# EAGLE design volume_board_v3 (EAGLE 8.4.3)
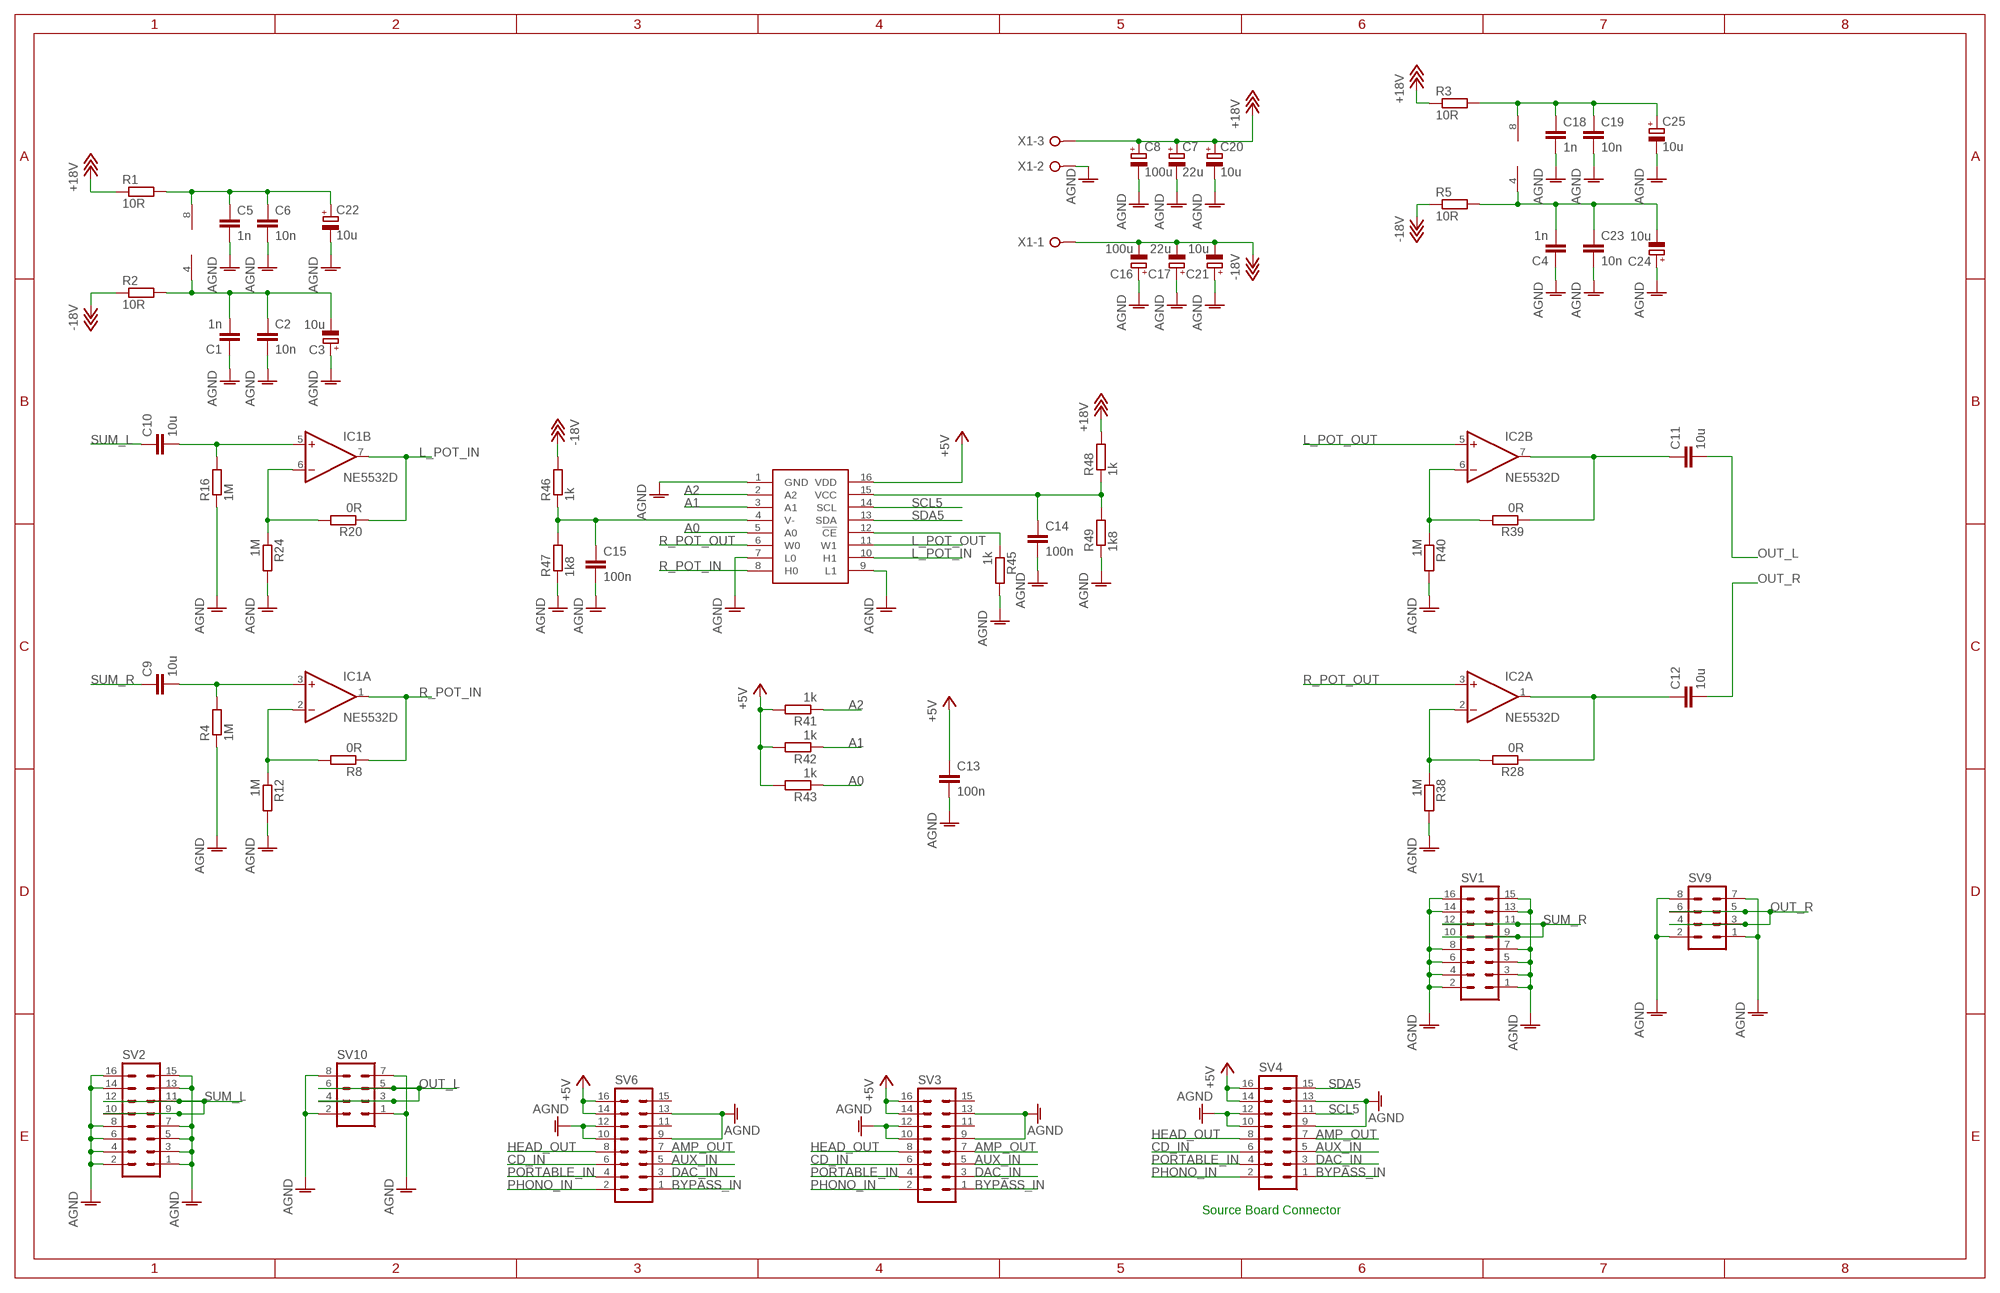
[diagram p0: schematic, sheet 1]

## Parts
C1  1n  C-EUC0603  [C0603]
C2  10n  C-EUC0603  [C0603]
C3  10u  CPOL-EU153CLV-0405  [153CLV-0405]
C4  1n  C-EUC0603  [C0603]
C5  1n  C-EUC0603  [C0603]
C6  10n  C-EUC0603  [C0603]
C7  22u  CPOL-EU153CLV-0405  [153CLV-0405]
C8  100u  CPOL-EU153CLV-0605  [153CLV-0605]
C9  10u  C5/7.2/11  [C5B7.2_11]
C10  10u  C5/7.2/11  [C5B7.2_11]
C11  10u  C5/7.2/11  [C5B7.2_11]
C12  10u  C5/7.2/11  [C5B7.2_11]
C13  100n  C-EUC0603  [C0603]
C14  100n  C-EUC0603  [C0603]
C15  100n  C-EUC0603  [C0603]
C16  100u  CPOL-EU153CLV-0605  [153CLV-0605]
C17  22u  CPOL-EU153CLV-0405  [153CLV-0405]
C18  1n  C-EUC0603  [C0603]
C19  10n  C-EUC0603  [C0603]
C20  10u  CPOL-EU153CLV-0405  [153CLV-0405]
C21  10u  CPOL-EU153CLV-0405  [153CLV-0405]
C22  10u  CPOL-EU153CLV-0405  [153CLV-0405]
C23  10n  C-EUC0603  [C0603]
C24  10u  CPOL-EU153CLV-0405  [153CLV-0405]
C25  10u  CPOL-EU153CLV-0405  [153CLV-0405]
IC1  NE5532D  [SO08]
IC2  NE5532D  [SO08]
IC4  DS1882  [SO16]
R1  10R  R-EU_R0603  [R0603]
R2  10R  R-EU_R0603  [R0603]
R3  10R  R-EU_R0603  [R0603]
R4  1M  R-EU_R0603  [R0603]
R5  10R  R-EU_R0603  [R0603]
R8  0R  R-EU_R0603  [R0603]
R12  1M  R-EU_R0603  [R0603]
R16  1M  R-EU_R0603  [R0603]
R20  0R  R-EU_R0603  [R0603]
R24  1M  R-EU_R0603  [R0603]
R28  0R  R-EU_R0603  [R0603]
R38  1M  R-EU_R0603  [R0603]
R39  0R  R-EU_R0603  [R0603]
R40  1M  R-EU_R0603  [R0603]
R41  1k  R-EU_R0603  [R0603]
R42  1k  R-EU_R0603  [R0603]
R43  1k  R-EU_R0603  [R0603]
R45  1k  R-EU_R0603  [R0603]
R46  1k  R-EU_R0603  [R0603]
R47  1k8  R-EU_R0603  [R0603]
R48  1k  R-EU_R0603  [R0603]
R49  1k8  R-EU_R0603  [R0603]
SV1  MA08-2  [MA08-2]
SV2  MA08-2  [MA08-2]
SV3  MA08-2  [MA08-2]
SV4  MA08-2B  [MA08-2_BORDER]
SV6  MA08-2  [MA08-2]
SV9  MA04-2  [MA04-2]
SV10  MA04-2  [MA04-2]
X1  W237-3E  [W237-3E]

## Nets
+5V: C13.1 IC4.16(VDD) R41.2 R42.2 R43.2 SV3.14 SV3.16 SV4.14 SV4.16 SV6.14 SV6.16
+18V: C7.+ C8.+ C20.+ R1.1 R3.1 R48.2 X1.3
-18V: C16.- C17.- C21.- R2.1 R5.1 R46.2 X1.1
A0: IC4.5(A0) R43.1
A1: IC4.3(A1) R42.1
A2: IC4.2(A2) R41.1
AMP_OUT: SV3.7 SV4.7 SV6.7
AUX_IN: SV3.5 SV4.5 SV6.5
BYPASS_IN: SV3.1 SV4.1 SV6.1
CD_IN: SV3.6 SV4.6 SV6.6
DAC_IN: SV3.3 SV4.3 SV6.3
GND: C1.1 C2.2 C3.+ C4.1 C5.2 C6.2 C7.- C8.- C13.2 C14.2 C15.2 C16.+ C17.+ C18.2 C19.2 C20.- C21.+ C22.- C23.2 C24.+ C25.- IC4.1(GND) IC4.7(L0) IC4.9(L1) R4.1 R12.2 R16.1 R24.2 R38.2 R40.2 R45.2 R47.1 R49.1 SV1.1 SV1.2 SV1.3 SV1.4 SV1.5 SV1.6 SV1.7 SV1.8 SV1.13 SV1.14 SV1.15 SV1.16 SV2.1 SV2.2 SV2.3 SV2.4 SV2.5 SV2.6 SV2.7 SV2.8 SV2.13 SV2.14 SV2.15 SV2.16 SV3.9 SV3.10 SV3.12 SV3.13 SV4.9 SV4.10 SV4.12 SV4.13 SV6.9 SV6.10 SV6.12 SV6.13 SV9.1 SV9.2 SV9.7 SV9.8 SV10.1 SV10.2 SV10.7 SV10.8 X1.2 ; supply symbol labelled AGND
HEAD_OUT: SV3.8 SV4.8 SV6.8
L_POT_IN: IC1.7(B:OUT) IC4.10(H1) R20.1
L_POT_OUT: IC2.5(B:+IN) IC4.11(W1)
N$1: C1.2 C2.1 C3.- IC1.4(P:V-) R2.2
N$2: C5.1 C6.1 C22.+ IC1.8(P:V+) R1.2
N$3: C18.1 C19.1 C25.+ IC2.8(P:V+) R3.2
N$4: C4.2 C23.1 C24.- IC2.4(P:V-) R5.2
N$28: IC1.2(A:-IN) R8.2 R12.1
N$30: C9.2 IC1.3(A:+IN) R4.2
N$31: IC1.6(B:-IN) R20.2 R24.1
N$32: C10.2 IC1.5(B:+IN) R16.2
N$35: IC2.2(A:-IN) R28.2 R38.1
N$36: IC2.6(B:-IN) R39.2 R40.1
N$37: C11.1 IC2.7(B:OUT) R39.1
N$38: C12.1 IC2.1(A:OUT) R28.1
N$41: IC4.12(!CE) R45.1
N$42: C15.1 IC4.4(V-) R46.1 R47.2
N$43: C14.1 IC4.15(VCC) R48.1 R49.2
OUT_L: C11.2 SV10.3 SV10.4 SV10.5 SV10.6
OUT_R: C12.2 SV9.3 SV9.4 SV9.5 SV9.6
PHONO_IN: SV3.2 SV4.2 SV6.2
PORTABLE_IN: SV3.4 SV4.4 SV6.4
R_POT_IN: IC1.1(A:OUT) IC4.8(H0) R8.1
R_POT_OUT: IC2.3(A:+IN) IC4.6(W0)
SCL5: IC4.14(SCL) SV4.11
SDA5: IC4.13(SDA) SV4.15
SUM_L: C10.1 SV2.9 SV2.10 SV2.11 SV2.12
SUM_R: C9.1 SV1.9 SV1.10 SV1.11 SV1.12
Unconnected: SV3.11 SV3.15 SV6.11 SV6.15

## Notes on the sheet
- Source Board Connector

## Library data of the parts
C1 C2 C4-C6 C13-C15 C18 C19 C23 = rcl:C-EU: CAPACITOR, European symbol
C3 C7 C8 C16 C17 C20-C22 C24 C25 = rcl:CPOL-EU: POLARIZED CAPACITOR, European symbol
C9-C12 = capacitor-wima:C: CAPACITOR naming: grid - package width
IC1 IC2 = linear:NE5532: AUDIO AMPLIFIER
IC4 = ds1882:DS1882
R1-R3 R5 = rcl:R-EU_: RESISTOR, European symbol
R4 R8 R12 R16 R20 R24 R28 R38-R43 R45-R49 = resistor:R-EU_: RESISTOR, European symbol
SV1-SV3 SV6 = con-lstb:MA08-2: PIN HEADER; OC_FARNELL: unknown; OC_NEWARK: unknown
SV4 = con-lstb:MA08-2: PIN HEADER
SV9 SV10 = con-lstb:MA04-2: PIN HEADER; OC_FARNELL: unknown; OC_NEWARK: unknown
X1 = con-wago-508:W237-3E: WAGO SREW CLAMP; OC_FARNELL: unknown; OC_NEWARK: unknown

## Board
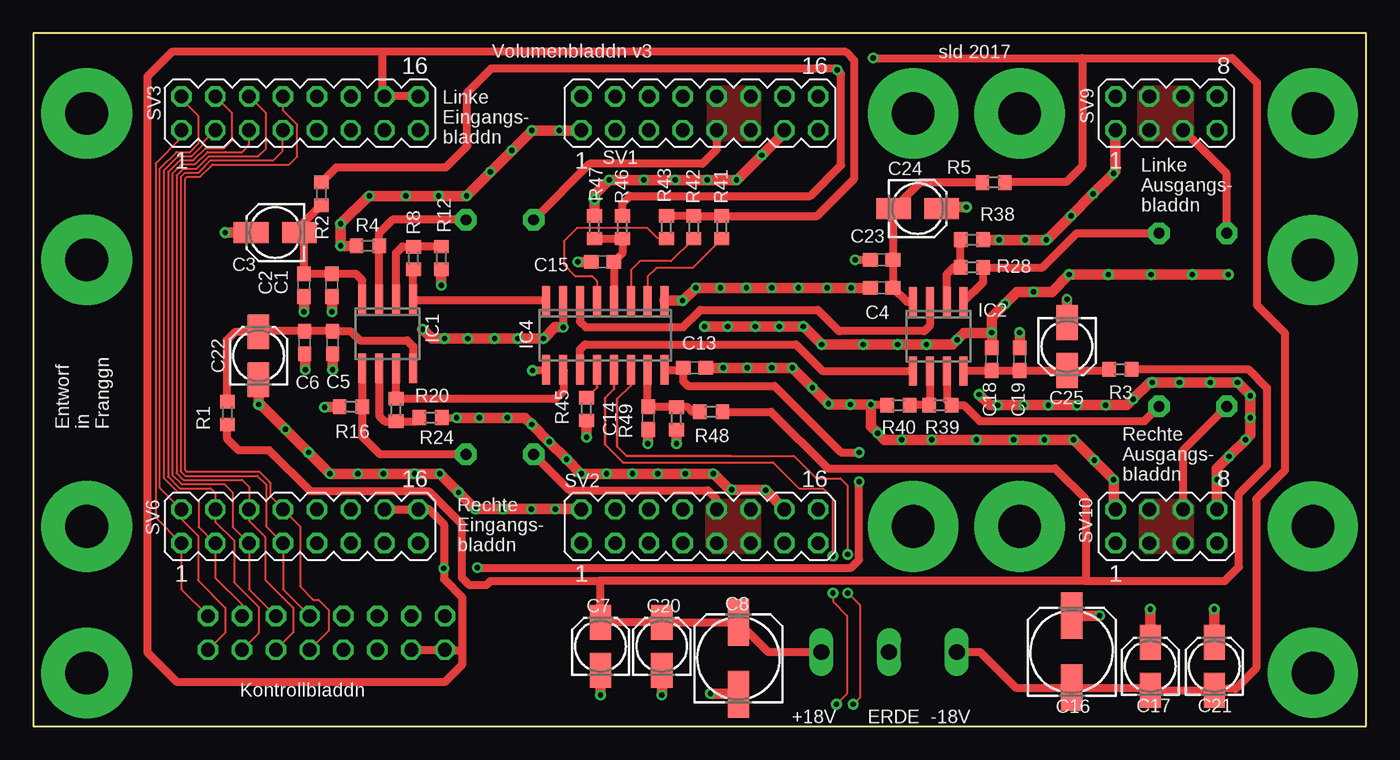
[diagram p1: board, top side]
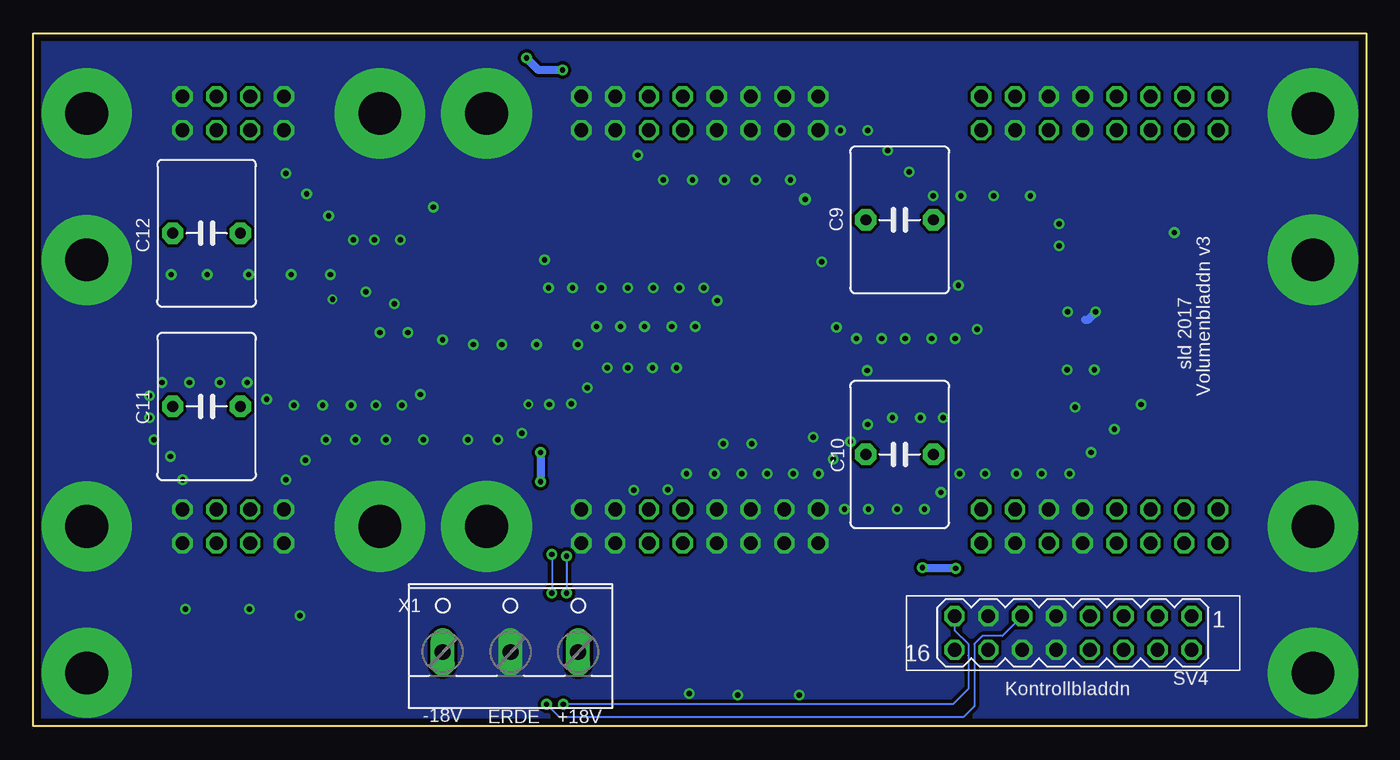
[diagram p2: board, bottom side, seen from below]

Size 100 x 52 mm. Coordinates in mm from the lower left corner, seen from the top.
Outline: 0,0 100,0 100,52 0,52 0,0
Copper layers (1*16): Top 0.035mm / dielectric 1.6mm / Bottom 0.035mm
Design rules "Elecrow_2-layer_PCB_eagle_rule": minimum track width 6mil, minimum drill 12mil, track to track 6mil, track to pad 8mil, pad to pad 12mil, via to via 12mil, smd to smd 0mil, copper to edge 20mil, drill to drill 10mil, minimum pad ring 6mil, minimum via ring 6mil, stop-mask expansion 0mil, vias tented up to drill 100mil, thermal gap 10mil

### Footprints (pad centres in the part's own frame; a part is rotated, then mirrored left to right if it is on the bottom)
C0603 = smd 1.1 x 1: 1 -0.85,0; 2 0.85,0
153CLV-0405 = smd 2.6 x 1.6: + 1.8,0; - -1.8,0
153CLV-0605 = smd 3.5 x 1.6: + 2.7,0; - -2.7,0
C5B7.2_11 = drill 0.813 pad 1.6 octagon: 1 -2.54,0; 2 2.54,0
SO08 = smd 0.6 x 2.2: 1 -1.905,-2.6; 2 -0.635,-2.6; 3 0.635,-2.6; 4 1.905,-2.6; 5 1.905,2.6; 6 0.635,2.6; 7 -0.635,2.6; 8 -1.905,2.6
SO16 = smd 0.6 x 2.2: 1 -4.445,-2.6; 2 -3.175,-2.6; 3 -1.905,-2.6; 4 -0.635,-2.6; 5 0.635,-2.6; 6 1.905,-2.6; 7 3.175,-2.6; 8 4.445,-2.6; 9 4.445,2.6; 10 3.175,2.6; 11 1.905,2.6; 12 0.635,2.6; 13 -0.635,2.6; 14 -1.905,2.6; 15 -3.175,2.6; 16 -4.445,2.6
R0603 = smd 1 x 1.1: 1 -0.85,0; 2 0.85,0
MA08-2 = drill 1.016 octagon: 1 -8.89,-1.27; 2 -8.89,1.27; 3 -6.35,-1.27; 4 -6.35,1.27; 5 -3.81,-1.27; 6 -3.81,1.27; 7 -1.27,-1.27; 8 -1.27,1.27; 9 1.27,-1.27; 10 1.27,1.27; 11 3.81,-1.27; 12 3.81,1.27; 13 6.35,-1.27; 14 6.35,1.27; 15 8.89,-1.27; 16 8.89,1.27
MA08-2_BORDER = drill 1.016 octagon: 1 -8.89,-1.27; 2 -8.89,1.27; 3 -6.35,-1.27; 4 -6.35,1.27; 5 -3.81,-1.27; 6 -3.81,1.27; 7 -1.27,-1.27; 8 -1.27,1.27; 9 1.27,-1.27; 10 1.27,1.27; 11 3.81,-1.27; 12 3.81,1.27; 13 6.35,-1.27; 14 6.35,1.27; 15 8.89,-1.27; 16 8.89,1.27
MA04-2 = drill 1.016 octagon: 1 -3.81,-1.27; 2 -3.81,1.27; 3 -1.27,-1.27; 4 -1.27,1.27; 5 1.27,-1.27; 6 1.27,1.27; 7 3.81,-1.27; 8 3.81,1.27
W237-3E = drill 1.194 long: 1 -5.08,-0.635; 2 0,-0.635; 3 5.08,-0.635

### Placement (x,y rotation side)
C1  22.4,33.1 90 top
C2  20.3,33.1 270 top
C3  18.15,37.05 180 top
C4  63.65,32.9 0 top
C5  22.45,28.8 270 top
C6  20.35,28.8 270 top
C7  42.55,6 90 top
C8  52.9,5.1 90 top
C9  35,38 0 bottom
C10  35,20.4 0 bottom
C11  87,24 180 bottom
C12  87,37 180 bottom
C13  49.6,26.9 0 top
C14  46.13,23.12 270 top
C15  42.7,34.85 180 top
C16  77.9,5.6 90 top
C17  83.8,4.5 90 top
C18  71.9,27.55 90 top
C19  74,27.55 90 top
C20  47.15,6 90 top
C21  88.6,4.5 90 top
C22  16.9,27.8 90 top
C23  63.65,35 180 top
C24  66.35,38.85 0 top
C25  77.55,28.5 270 top
IC1  26.58,29.46 180 top
IC2  67.89,29.26 180 top
IC4  42.92,29.34 180 top
R1  14.55,23.5 90 top
R2  21.6,39.95 270 top
R3  81.55,26.8 180 top
R4  25.1,36.05 0 top
R5  72.05,40.8 180 top
R8  28.53,35.13 90 top
R12  30.6,35.15 270 top
R16  23.83,23.97 0 top
R20  27.22,23.73 270 top
R24  29.8,23.17 0 top
R28  70.42,34.43 180 top
R38  70.42,36.52 0 top
R39  68.05,24.1 180 top
R40  64.9,24.1 180 top
R41  51.65,37.45 90 top
R42  49.55,37.45 90 top
R43  47.5,37.45 90 top
R45  41.5,23.8 270 top
R46  44.2,37.45 90 top
R47  42.1,37.45 270 top
R48  50.85,23.6 0 top
R49  48.25,23.1 90 top
SV1  50,46 0 top
SV2  50,15 0 top
SV3  20,46 0 top
SV4  22,7 180 bottom
SV6  20,15 0 top
SV9  85,46 0 top
SV10  85,15 0 top
X1  64.2,6.2 0 bottom

### Tracks (layer width: path | path; a pad name or v marks a point on that pad's centre or on a via)
+5V  (via drill 0.4 pad 0.8)
  Top 0.4: SV3.16
  Top 0.6: SV6.14 SV6.16 29.68,16.27 30.8,15.15 v30.8,11.85 30.8,11.05 32.2,9.65 32.2,5.7 | SV3.16 SV3.14 26.2,47.42 26.2,50.6 | SV4.14 SV4.16 30.92,5.7 32.2,5.7 | R43.2 R42.2 R41.2 58.8,38.3 61.6,41.1 61.6,49.95 60.95,50.6 26.2,50.6 | 47.37,26.08 IC4.16 48.59,26.74 C13.1 48.75,25.9 49.1,25.55 55.6,25.55 60.6,20.55 v61.95,20.55 | 26.2,50.6 10.4,50.6 8.55,48.75 8.55,5.55 10.75,3.35 30.9,3.35 32.2,4.65 32.2,5.7 | v33.3,11.9 61.35,11.9 61.95,12.5 v61.95,18.35
  Bottom 0.6: v33.3,11.9 30.85,11.9 v30.8,11.85 | v61.95,20.55 v61.95,18.35
+18V
  Top 0.6: R3.1 91.15,26.8 92.55,25.4 92.55,19.55 90.45,17.45 90.45,11.95 89.4,10.9 78.95,10.9 | R48.2 55.35,23.6 59.6,19.35 76.65,19.35 78.95,17.05 78.95,10.9 | R1.1 14.55,21.55 15.4,20.7 17.7,20.7 20.75,17.65 29.65,17.65 32.15,15.15 32.15,11.15 32.7,10.6 34,10.6 34.3,10.9 42.4,10.9 | X1.3 55.13,5.57 C8.+ C20.+ C7.+ 42.55,10.75 42.4,10.9 | 78.95,10.9 42.4,10.9
-18V  (via drill 0.4 pad 0.8)
  Top 0.6: X1.1 71.03,5.57 73.7,2.9 C16.- 83.6,2.9 C17.- C21.- 88.7,2.8 90.2,2.8 91.75,4.35 91.75,17.05 93.9,19.2 93.9,29.5 91.8,31.6 91.8,48.3 89.95,50.15 78.7,50.15 | R2.1 22.75,41.95 30.95,41.95 32.55,43.55 32.55,47.55 34.35,49.35 60.2,49.35 v60.3,49.25 60.6,48.95 60.6,42.1 58.3,39.8 44.75,39.8 44.2,39.25 R46.2 | R5.1 73.05,40.85 77.5,40.85 78.7,42.05 78.7,50.15 | v63,50.15 78.7,50.15
  Bottom 0.6: v60.3,49.25 62.1,49.25 v63,50.15
A0
  Top 0.16: R43.1 46.85,36.6 46.07,37.38 40.78,37.38 39.8,36.4 39.8,34.65 40.65,33.8 41.9,33.8 42.3,33.4 42.29,33.39 IC4.5
A1
  Top 0.16: R42.1 47.85,34.9 45.5,34.9 44.83,34.23 IC4.3
A2
  Top 0.16: R41.1 49.45,34.4 46.75,34.4 46.1,33.75 IC4.2
AMP_OUT
  Top 0.16: SV3.7 18.7,44.7 18.7,43.15 18.01,42.46 13.32,42.46 12.4,41.54 11.4,41.54 11.05,41.2 11.05,19.12 11.38,18.8 16.8,18.8 17.45,18.15 17.45,15.01 SV6.7 18.73,10.27 SV4.7
AUX_IN
  Top 0.16: SV3.5 16.19,43.64 15.65,43.1 14.44,43.1 14.43,43.09 13.06,43.09 12.14,42.16 11.14,42.16 10.43,41.45 10.43,18.86 11.12,18.18 14.32,18.18 14.95,17.55 14.95,14.97 SV6.5 16.19,10.27 SV4.5
BYPASS_IN
  Top 0.16: SV3.1 11.11,44.16 9.18,42.23 9.18,15.66 SV6.1 11.11,10.27 SV4.1
CD_IN
  Top 0.16: SV3.6 17.45,46.01 17.45,43.35 16.88,42.77 13.19,42.77 12.27,41.85 11.27,41.85 10.74,41.33 10.74,18.99 11.25,18.49 15.66,18.49 16.2,17.95 SV6.6 16.19,15.41 17.4,14.2 17.4,11 19.5,8.9 19.5,7.04 SV4.6
DAC_IN
  Top 0.16: 13.65,13.7 12.4,14.95 12.4,16.9 11.75,17.55 10.86,17.55 9.8,18.6 9.8,41.71 10.88,42.79 11.88,42.79 12.71,43.62 12.71,43.79 SV3.3 | SV6.3 13.65,11.15 15.65,9.15 SV4.3
  Top 0.2: 13.65,13.7 SV6.3
GND  (via drill 0.4, 0.4 pad 0.8, 0.4 pad 0.9, 3.2 pad 6.75, 3.2 pad 6.8)
  Top 0.6: 21.87,23.97 v21.85,23.95 | R24.2 v31.75,23.15 | C6.2 20.4,27.9 | IC4.7 v39.75,29.95 | IC4.9 38.43,26.7 v37.45,26.7 | C23.2 v61.65,35 | C24.+ 68.25,38.95 | R38.2 71.28,36.5 | R40.2 62.9,24.1 v62.85,24.15 | 71.9,29.5 v71.9,29.55 | 46.13,21.23 v46.1,21.2 | C8.- 52.85,2.45
  Top 0.8: 56.4,16.25 v54.95,17.7 54.9,17.75 v52.4,17.75 52.25,17.75 51.05,18.95 v51,18.95 v48.9,18.95 v46.85,18.95 v44.95,18.95 v43,18.95 v41.1,18.95 v40,20.05 v38.7,21.35 v37.4,22.65 36.9,23.15 v35.55,23.15 v33.45,23.15 v31.75,23.15 | R47.1 v42.1,39.55 42.1,39.9 v43.2,41 v45.8,41 v48.15,41 v50.55,41 v52.75,41 52.8,41 v54.65,42.85 56.4,44.6 | C16.+ v80,8.3 | C17.+ v83.8,8.8 | C21.+ v88.6,8.8 | R45.2 v41.5,21.7 | R4.1 v23.05,36.05 v23.05,37.7 25.15,39.8 v25.2,39.8 v27.95,39.8 v30.4,39.8 v32.5,39.8 v34.3,41.6 v35.9,43.2 v37.4,44.7 v39.45,44.7 41.08,44.7 SV1.1 | R12.2 v30.6,33.1 | R16.1 21.87,23.97 | C1.1 v22.4,31.1 | C2.2 v20.3,31.1 | C5.2 v22.45,26.75 | 20.4,27.9 v20.4,26.75 | C22.- v16.9,24.15 | C3.+ v14.4,37.05 | C15.2 v40.85,34.85 | 68.25,38.95 v70,38.95 | 71.28,36.5 v72.45,36.5 v74.4,36.5 v76,36.5 76.05,36.5 v77.85,38.3 v79.5,39.95 v81.05,41.5 81.19,41.64 SV9.1 | C18.2 71.9,29.5 69.8,29.5 v69.3,29 68.95,28.65 v67,28.65 v64.85,28.65 v62.25,28.65 v59.15,28.65 57.8,30 v57.75,30 v55.95,30 v54.15,30 v52.1,30 v50.35,30 | C19.2 v74,29.55 | C25.- v77.55,32.05 | C13.2 v51.75,26.9 v53.55,26.9 v55.4,26.9 v56.95,26.9 v58.45,25.4 v59.65,24.2 59.7,24.15 v61.3,24.15 v62.85,24.15 62.85,22.5 v63.35,22 63.85,21.5 v65.15,21.5 v67.4,21.5 v70.75,21.5 v73.55,21.5 v75.85,21.5 v78.05,21.5 v79.6,19.95 v81.05,18.5 81.05,16.41 SV10.2 | C14.2 46.13,21.23 | R49.1 v48.25,21.2 | 52.85,2.45 v50.8,2.45 | C20.- v47.15,2.35 | C7.- v42.55,2.35 | C4.1 v61.35,32.9 v59.55,32.9 v57.4,32.9 v55.4,32.9 v53.5,32.9 v51.55,32.9 v49.7,32.9 48.75,31.95 v48.7,31.95 IC4.1 | 17,24.2 v18.9,22.3 v20.65,20.55 v22.25,18.95 v24.35,18.95 v26.25,18.95 v28.6,18.95 v30.5,18.95 v31.9,17.55 v33.15,16.3 v35.2,16.3 v37.35,16.3 v39.15,16.3 41.08,16.3 SV2.2
  Top 0.8: v39.75,29.95 39.15,29.95 38.3,29.1 v38.25,29.1 v36.35,29.1 v34.6,29.1 v32.6,29.1 v30.85,29.1 29.9,29.1 v29.2,29.8 | v71.9,29.55 71.9,30.7 v72.9,31.7 73.8,32.6 v75.05,32.6 76.4,32.6 v77.7,33.9 v80.65,33.9 v83.85,33.9 v86.95,33.9 v89.65,33.9 | v70.95,24.9 71.75,24.1 v72.35,24.1 v74.3,24.1 v76.15,24.1 v78.3,24.1 v80.45,24.1 82.05,24.1 v82.5,24.55 83.75,25.8 v83.95,25.8 v86,25.8 v88.3,25.8 v90.35,25.8 91.3,24.85 v91.3,24.8 v91.3,23.15 91.3,21.85 v90.95,21.5 v89.7,20.25 88.8,19.35 v88.8,18.5 SV10.8
  Bottom 0.6: v20.3,31.1 20.9,30.5 21.1,30.5
  other vias: 4,46 4,4 96,4 66,46 74,46 4,15 74,15 66,15 4,35 96,35 96,46 96,15
  pour Bottom (isolate 0.25, no thermals): 0,52 100,52 100.33,0 0,0
HEAD_OUT
  Top 0.16: SV3.8 18.73,46.21 19.8,45.14 19.8,42.75 19.2,42.15 13.45,42.15 12.53,41.23 11.55,41.23 11.37,41.04 11.37,19.25 11.51,19.11 16.93,19.11 17.76,18.28 17.76,17.28 18.75,16.29 SV6.8 20,15 20,10.5 21,9.5 21.4,9.5 22.15,8.75 22.15,7.15 SV4.8
L_POT_IN
  Top 0.6: R20.1 IC1.7 | R20.1 | 27.33,24.7 27.23,24.6 | 27.23,24.6 R20.1 | IC4.10 39.8,26.69 39.8,25.2 39.2,24.6 27.23,24.6
L_POT_OUT
  Top 0.6: IC4.11 41.02,28.27 41.4,28.65 57.2,28.65 59.19,26.66 IC2.5
N$1
  Top 0.6: IC1.4 24.68,33.47 24.2,33.95 C1.2 C2.1 20.3,36.7 C3.- 19.95,37.45 R2.2
N$2
  Top 0.6: IC1.8 28.5,28.5 28.05,28.95 24.5,28.95 23.8,29.65 C5.1 C6.1 16.95,29.65 C22.+ 15.15,29.6 14.5,28.95 14.5,24.4 R1.2
N$3
  Top 0.6: IC2.8 69.84,26.7 C18.1 C19.1 C25.+ 80.6,26.7 R3.2
N$4
  Top 0.6: IC2.4 65.54,31.86 C4.2 C23.1 64.5,38.8 C24.- 66.5,40.8 R5.2
N$28
  Top 0.6: R12.1 28.55,36 R8.2 28.51,36 27.7,36 27.22,35.52 IC1.2
N$30
  Top 0.6: IC1.3 R4.2 25.95,37 27,38.05 32.41,38.05 C9.2
N$31
  Top 0.6: IC1.6 25.95,23.3 26.37,22.88 R20.2 28.67,22.88 R24.1
N$32
  Top 0.6: IC1.5 R16.2 24.7,23.95 24.7,21.7 26,20.4 C10.2
N$35
  Top 0.6: IC2.2 68.53,33.93 69.03,34.43 R28.2 R38.1
N$36
  Top 0.6: R40.1 R39.2 67.26,24.16 IC2.6
N$37
  Top 0.6: IC2.7 68.53,24.47 R39.1 69.8,24.1 71,22.9 83.36,22.9 C11.1 84.36,24.1
N$38
  Top 0.6: C12.1 78.28,37 75.72,34.43 R28.1 71.27,33.33 IC2.1
N$41
  Top 0.2: IC4.12 42.29,25.44 R45.1
N$42
  Top 0.6: IC4.4 C15.1 44.2,35.5 R46.1 R47.2
N$43
  Top 0.6: 46.1,24 IC4.15 | C14.1 46.1,24 | 46.1,24 46.15,23.95 R49.2 49.1,23.95 49.45,23.6 R48.1
OUT_L
  Top 0.6: SV10.6 86.27,20.73 C11.2
  pour Top (no thermals): 83,16.6 83.4,17 86.6,17 87,16.6 87,13.4 86.6,13 83.4,13 83,13.4
OUT_R
  Top 0.6: C12.2 89.54,41.46 SV9.5
  pour Top (no thermals): 82.9,47.6 83.3,48 86.6,48 87,47.6 87,44.5 86.5,44 83.3,44 82.9,44.4
PHONO_IN
  Top 0.16: SV3.2 11.11,47.09 12.4,45.8 12.4,43.75 11.75,43.1 10.75,43.1 9.49,41.84 9.49,17.89 SV6.2 11.11,15.54 12.35,14.3 12.35,10.95 14.4,8.9 14.4,7.02 SV4.2
  Top 0.2: 11.04,16.2 SV6.2
PORTABLE_IN
  Top 0.16: SV3.4 14.9,46.02 14.9,44 14.3,43.4 12.93,43.4 12.01,42.48 11.01,42.48 10.12,41.58 10.12,18.73 10.99,17.86 13.29,17.86 13.65,17.5 13.65,16 | SV6.4 13.65,15.35 15.05,13.95 15.05,10.8 16.9,8.95 16.9,6.98 SV4.4
  Top 0.2: 13.65,16 SV6.4
R_POT_IN
  Top 0.6: R8.1 28.49,34.24 IC1.1 28.6,31.94 IC4.8
R_POT_OUT
  Top 0.6: IC4.6 41.02,30.38 41.45,29.95 48.75,29.95 50.05,31.25 58.85,31.25 60.45,29.65 66.85,29.65 67.26,30.06 IC2.3
SCL5  (via drill 0.4 pad 0.8)
  Top 0.16: 52.3,20.3 57.05,20.3 58.75,18.6 60.55,18.6 61.1,18.05 v61.1,12.9 | v61.1,10 62,9.1 62,2.15 v61.5,1.65
  Top 0.2: 44.85,26.72 IC4.14 44.83,25.58 43.8,24.55 43.8,21 44.5,20.3 52.3,20.3
  Bottom 0.16: SV4.11 27.3,6.78 28.78,6.78 29.39,6.16 29.39,5.05 29.4,5.05 29.4,1.5 30.2,0.7 60.55,0.7 v61.5,1.65 | v61.1,12.9 61.1,13.15 v61.1,10
SDA5  (via drill 0.4 pad 0.8)
  Top 0.16: 44.25,19.8 55.5,19.8 57.48,17.82 59.27,17.82 59.99,17.11 v59.99,12.75 | v59.99,10 59.99,9.36 61.05,8.3 61.05,2.45 v60.25,1.65
  Top 0.2: IC4.13 43.56,25.31 42.9,24.65 42.9,21.15 44.25,19.8
  Bottom 0.16: SV4.15 30.89,7.21 29.84,6.16 29.84,5.3 29.85,5.29 29.85,2.8 31,1.65 v60.25,1.65 | v59.99,12.75 59.99,10.05 v59.99,10
SUM_L
  Top 0.6: C10.1 40.24,17.7 50.6,17.7 51.25,17.05 51.25,16.29 SV2.10
  pour Top (no thermals): 50.5,16.6 50.9,17 54.1,17 54.5,16.6 54.5,13.4 54.1,13 51,13 50.5,13.5
SUM_R
  Top 0.6: SV1.9 51.27,43.27 50.2,42.2 41.74,42.2 C9.1
  pour Top (no thermals): 50.9,48 54.1,48 54.5,47.6 54.5,44.4 54.1,44 51,44 50.6,44.4 50.6,47.7

### Text on the board
tNames: Volumenbladdn v3 | sld 2017 | Linke / Eingangs- / bladdn | Linke / Ausgangs- / bladdn | Entworf / in / Franggn | Rechte / Ausgangs- / bladdn | Rechte / Eingangs- / bladdn | Kontrollbladdn | +18V | ERDE | -18V
bNames: Volumenbladdn v3 | sld 2017 | Kontrollbladdn | +18V | ERDE | -18V